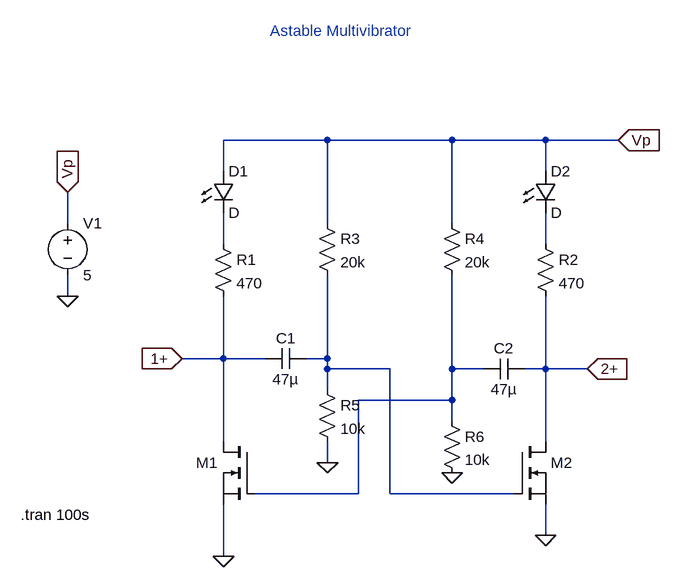
[diagram p0: schematic astable_multivib_ltspice.asc]
astable_multivib_ltspice.asc, the LTspice schematic file:
Version 4
SHEET 1 1832 680
WIRE 256 -608 96 -608
WIRE 448 -608 256 -608
WIRE 592 -608 448 -608
WIRE 704 -608 592 -608
WIRE 96 -560 96 -608
WIRE 592 -560 592 -608
WIRE -144 -480 -144 -528
WIRE 256 -480 256 -608
WIRE 448 -480 448 -608
WIRE 96 -448 96 -496
WIRE 592 -448 592 -496
WIRE -144 -368 -144 -400
WIRE 96 -272 96 -368
WIRE 96 -272 32 -272
WIRE 160 -272 96 -272
WIRE 256 -272 256 -400
WIRE 256 -272 224 -272
WIRE 256 -256 256 -272
WIRE 352 -256 256 -256
WIRE 448 -256 448 -400
WIRE 496 -256 448 -256
WIRE 592 -256 592 -368
WIRE 592 -256 560 -256
WIRE 656 -256 592 -256
WIRE 256 -224 256 -256
WIRE 448 -208 448 -256
WIRE 448 -208 304 -208
WIRE 448 -176 448 -208
WIRE 96 -144 96 -272
WIRE 592 -144 592 -256
WIRE 256 -112 256 -144
WIRE 304 -64 304 -208
WIRE 304 -64 144 -64
WIRE 352 -64 352 -256
WIRE 544 -64 352 -64
WIRE 592 0 592 -48
WIRE 96 32 96 -48
FLAG 96 32 0
FLAG 592 0 0
FLAG 704 -608 Vp
IOPIN 704 -608 In
FLAG 32 -272 1+
IOPIN 32 -272 In
FLAG 656 -256 2+
IOPIN 656 -256 In
FLAG -144 -368 0
FLAG -144 -528 Vp
IOPIN -144 -528 In
FLAG 256 -112 0
FLAG 448 -96 0
SYMBOL res 80 -464 R0
SYMATTR InstName R1
SYMATTR Value 470
SYMBOL res 576 -464 R0
SYMATTR InstName R2
SYMATTR Value 470
SYMBOL res 240 -496 R0
SYMATTR InstName R3
SYMATTR Value 20k
SYMBOL res 432 -496 R0
SYMATTR InstName R4
SYMATTR Value 20k
SYMBOL cap 224 -288 R90
WINDOW 0 0 32 VBottom 2
WINDOW 3 32 32 VTop 2
SYMATTR InstName C1
SYMATTR Value 47µ
SYMBOL cap 560 -272 R90
WINDOW 0 0 32 VBottom 2
WINDOW 3 32 32 VTop 2
SYMATTR InstName C2
SYMATTR Value 47µ
SYMBOL LED 80 -560 R0
SYMATTR InstName D1
SYMBOL LED 576 -560 R0
SYMATTR InstName D2
SYMBOL voltage -144 -496 R0
WINDOW 123 0 0 Left 0
WINDOW 39 0 0 Left 0
SYMATTR InstName V1
SYMATTR Value 5
SYMBOL nmos 144 -144 M0
WINDOW 3 56 72 Invisible 2
SYMATTR InstName M1
SYMATTR Value BSP89
SYMBOL nmos 544 -144 R0
WINDOW 3 56 72 Invisible 2
SYMATTR InstName M2
SYMATTR Value BSP89
SYMBOL res 240 -240 R0
SYMATTR InstName R5
SYMATTR Value 10k
SYMBOL res 432 -192 R0
SYMATTR InstName R6
SYMATTR Value 10k
TEXT -216 -32 Left 2 !.tran 100s
TEXT 168 -776 Left 2 ;Astable Multivibrator

The netlist it stands for:
* astable_multivib_ltspice.asc
R1 N001 1+ 470
R2 N002 2+ 470
R3 Vp N003 20k
R4 Vp N004 20k
C1 N003 1+ 47µ
C2 2+ N004 47µ
D1 Vp N001 D
D2 Vp N002 D
V1 Vp 0 5
M1 1+ N004 0 0 BSP89
M2 2+ N003 0 0 BSP89
R5 N003 0 10k
R6 N004 0 10k
.model D D
.lib standard.dio
.model NMOS NMOS
.model PMOS PMOS
.lib standard.mos
.tran 100s
* Astable Multivibrator
.backanno
.end